# EasyEDA Pro project 栏杆机费显主板.epro, schematic Schematic1

## Sheets
1 P1: Create Date: 2023-12-23; Page Name: P1; Project Name: F407-费显; Schematic Name: Schematic1; Update Date: 2023-12-23; Company: 嘉立创EDA; Page Size: A3; Version: V1.0
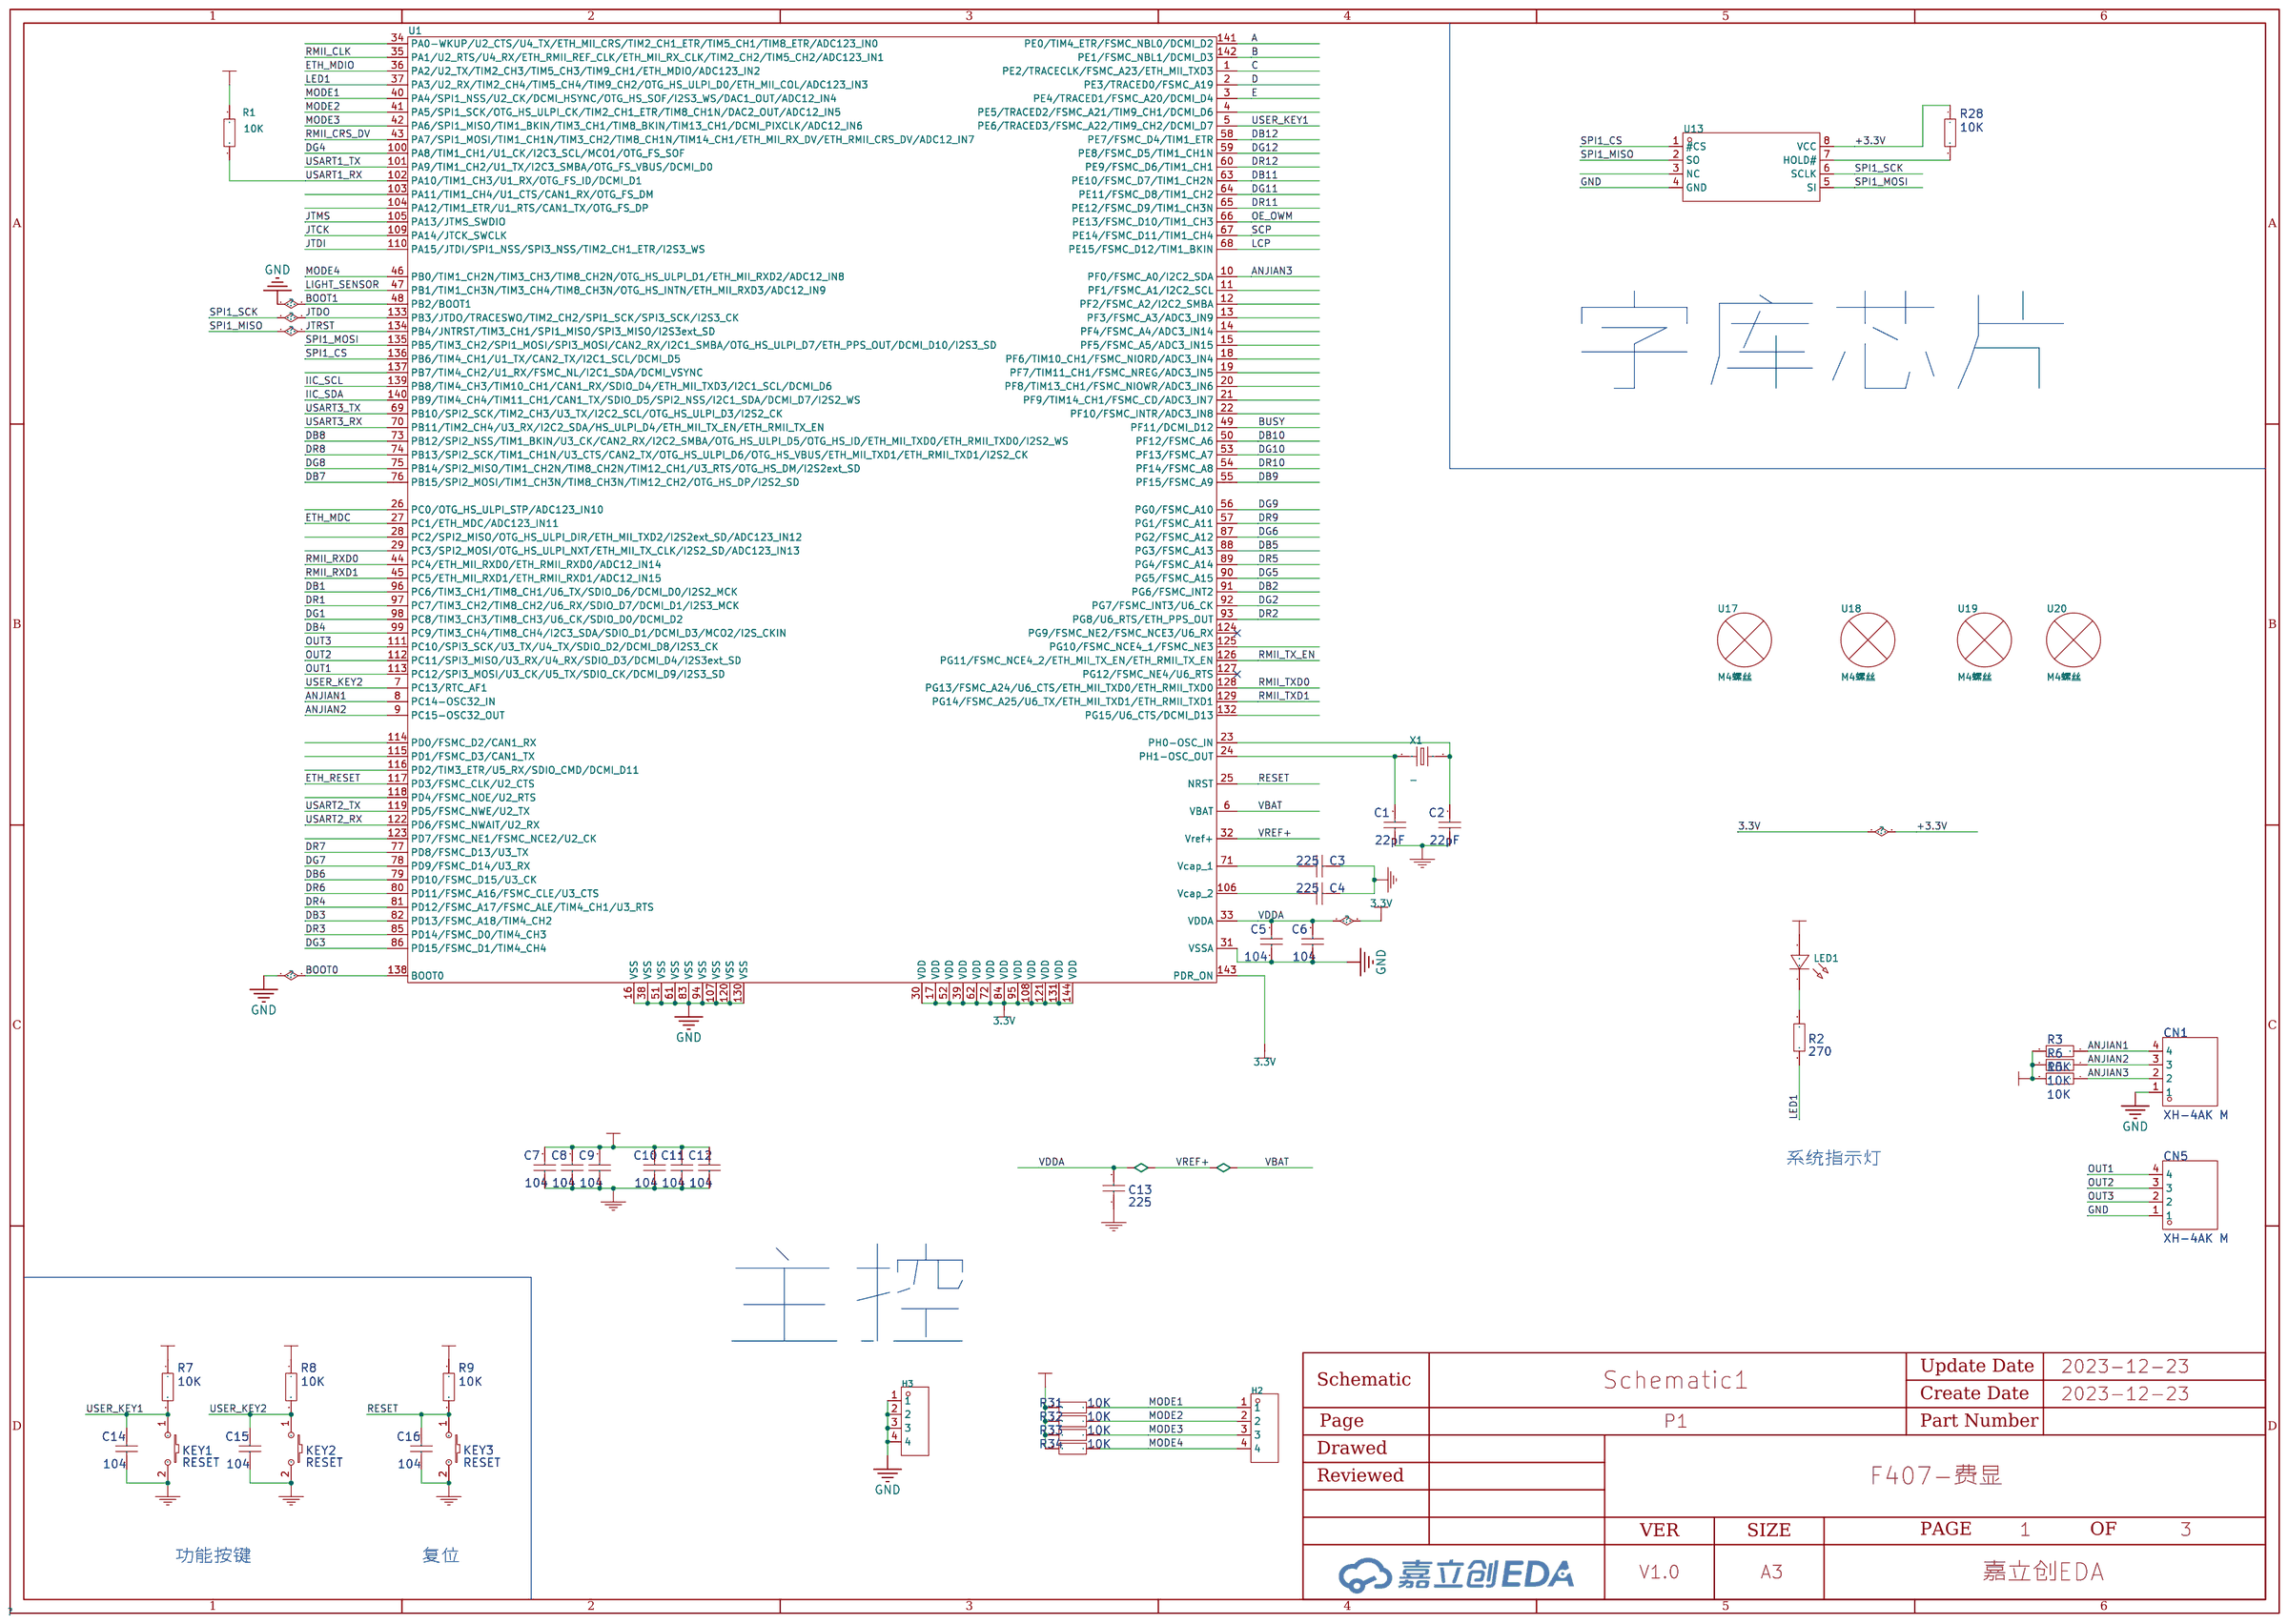
[diagram p0: P1]
2 P2: Page Name: P2
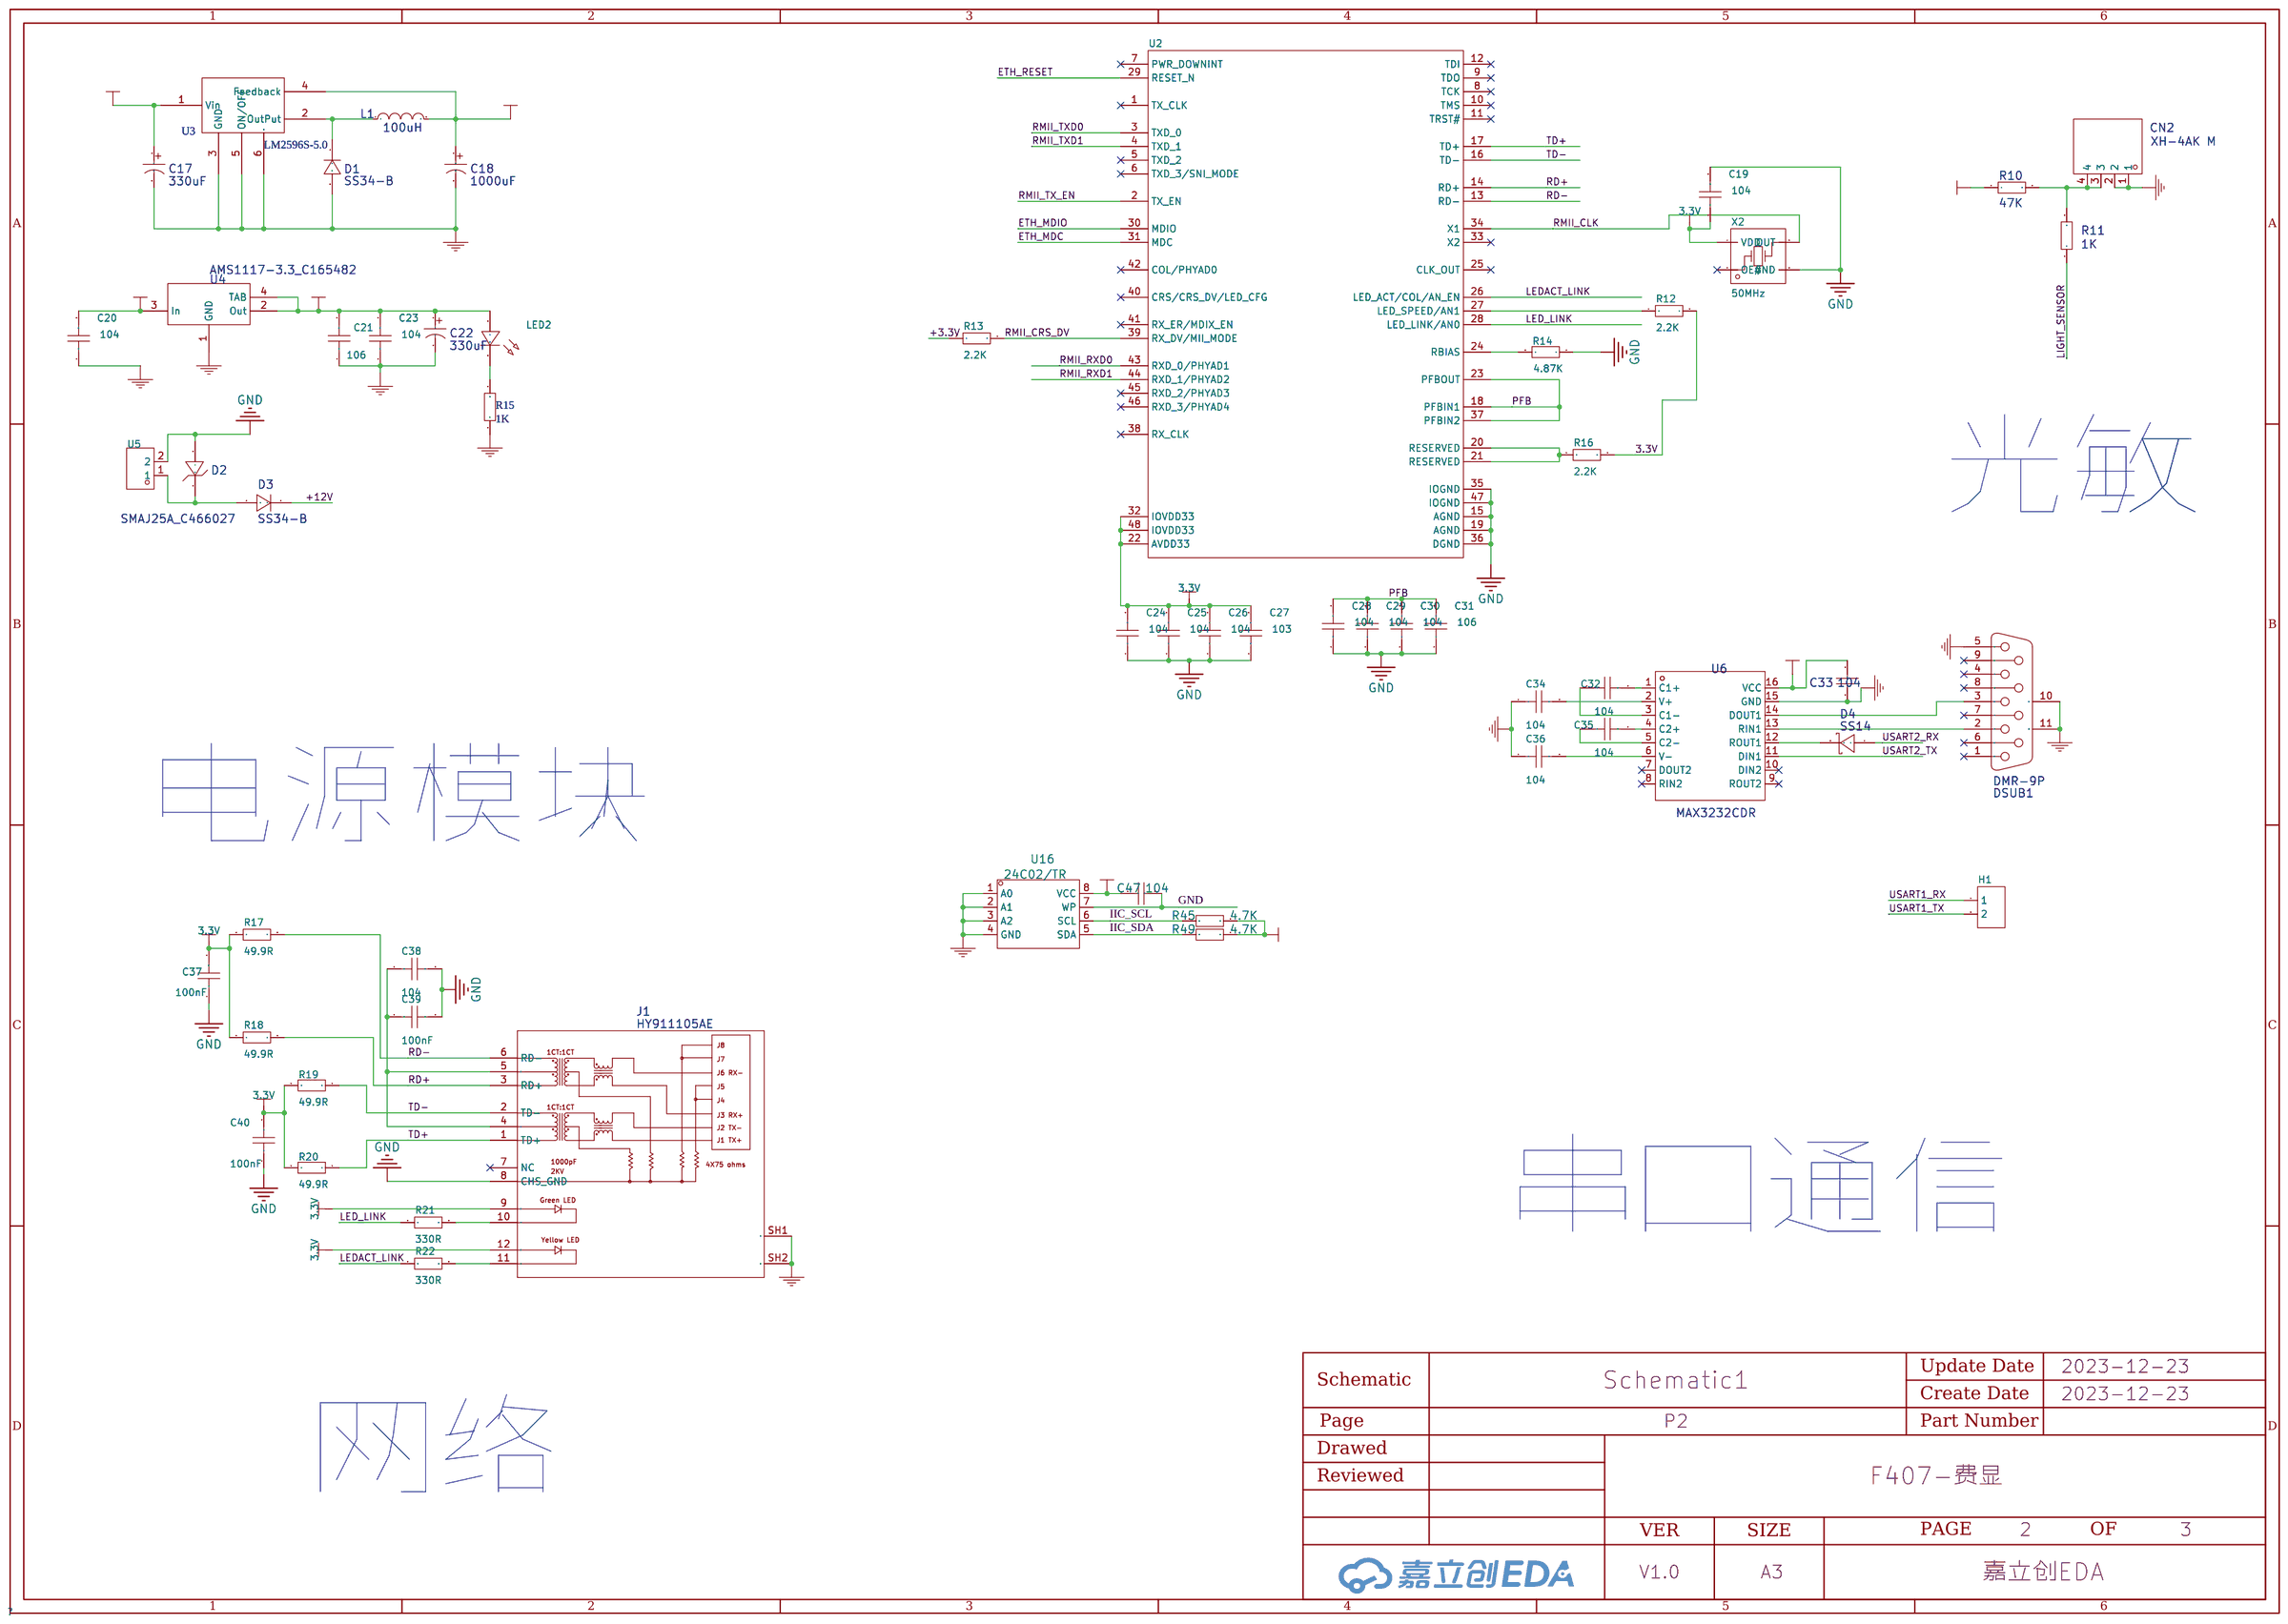
[diagram p1: P2]
3 P3: Create Date: 2023-06-13; Page Name: P3; Update Date: 2023-06-14
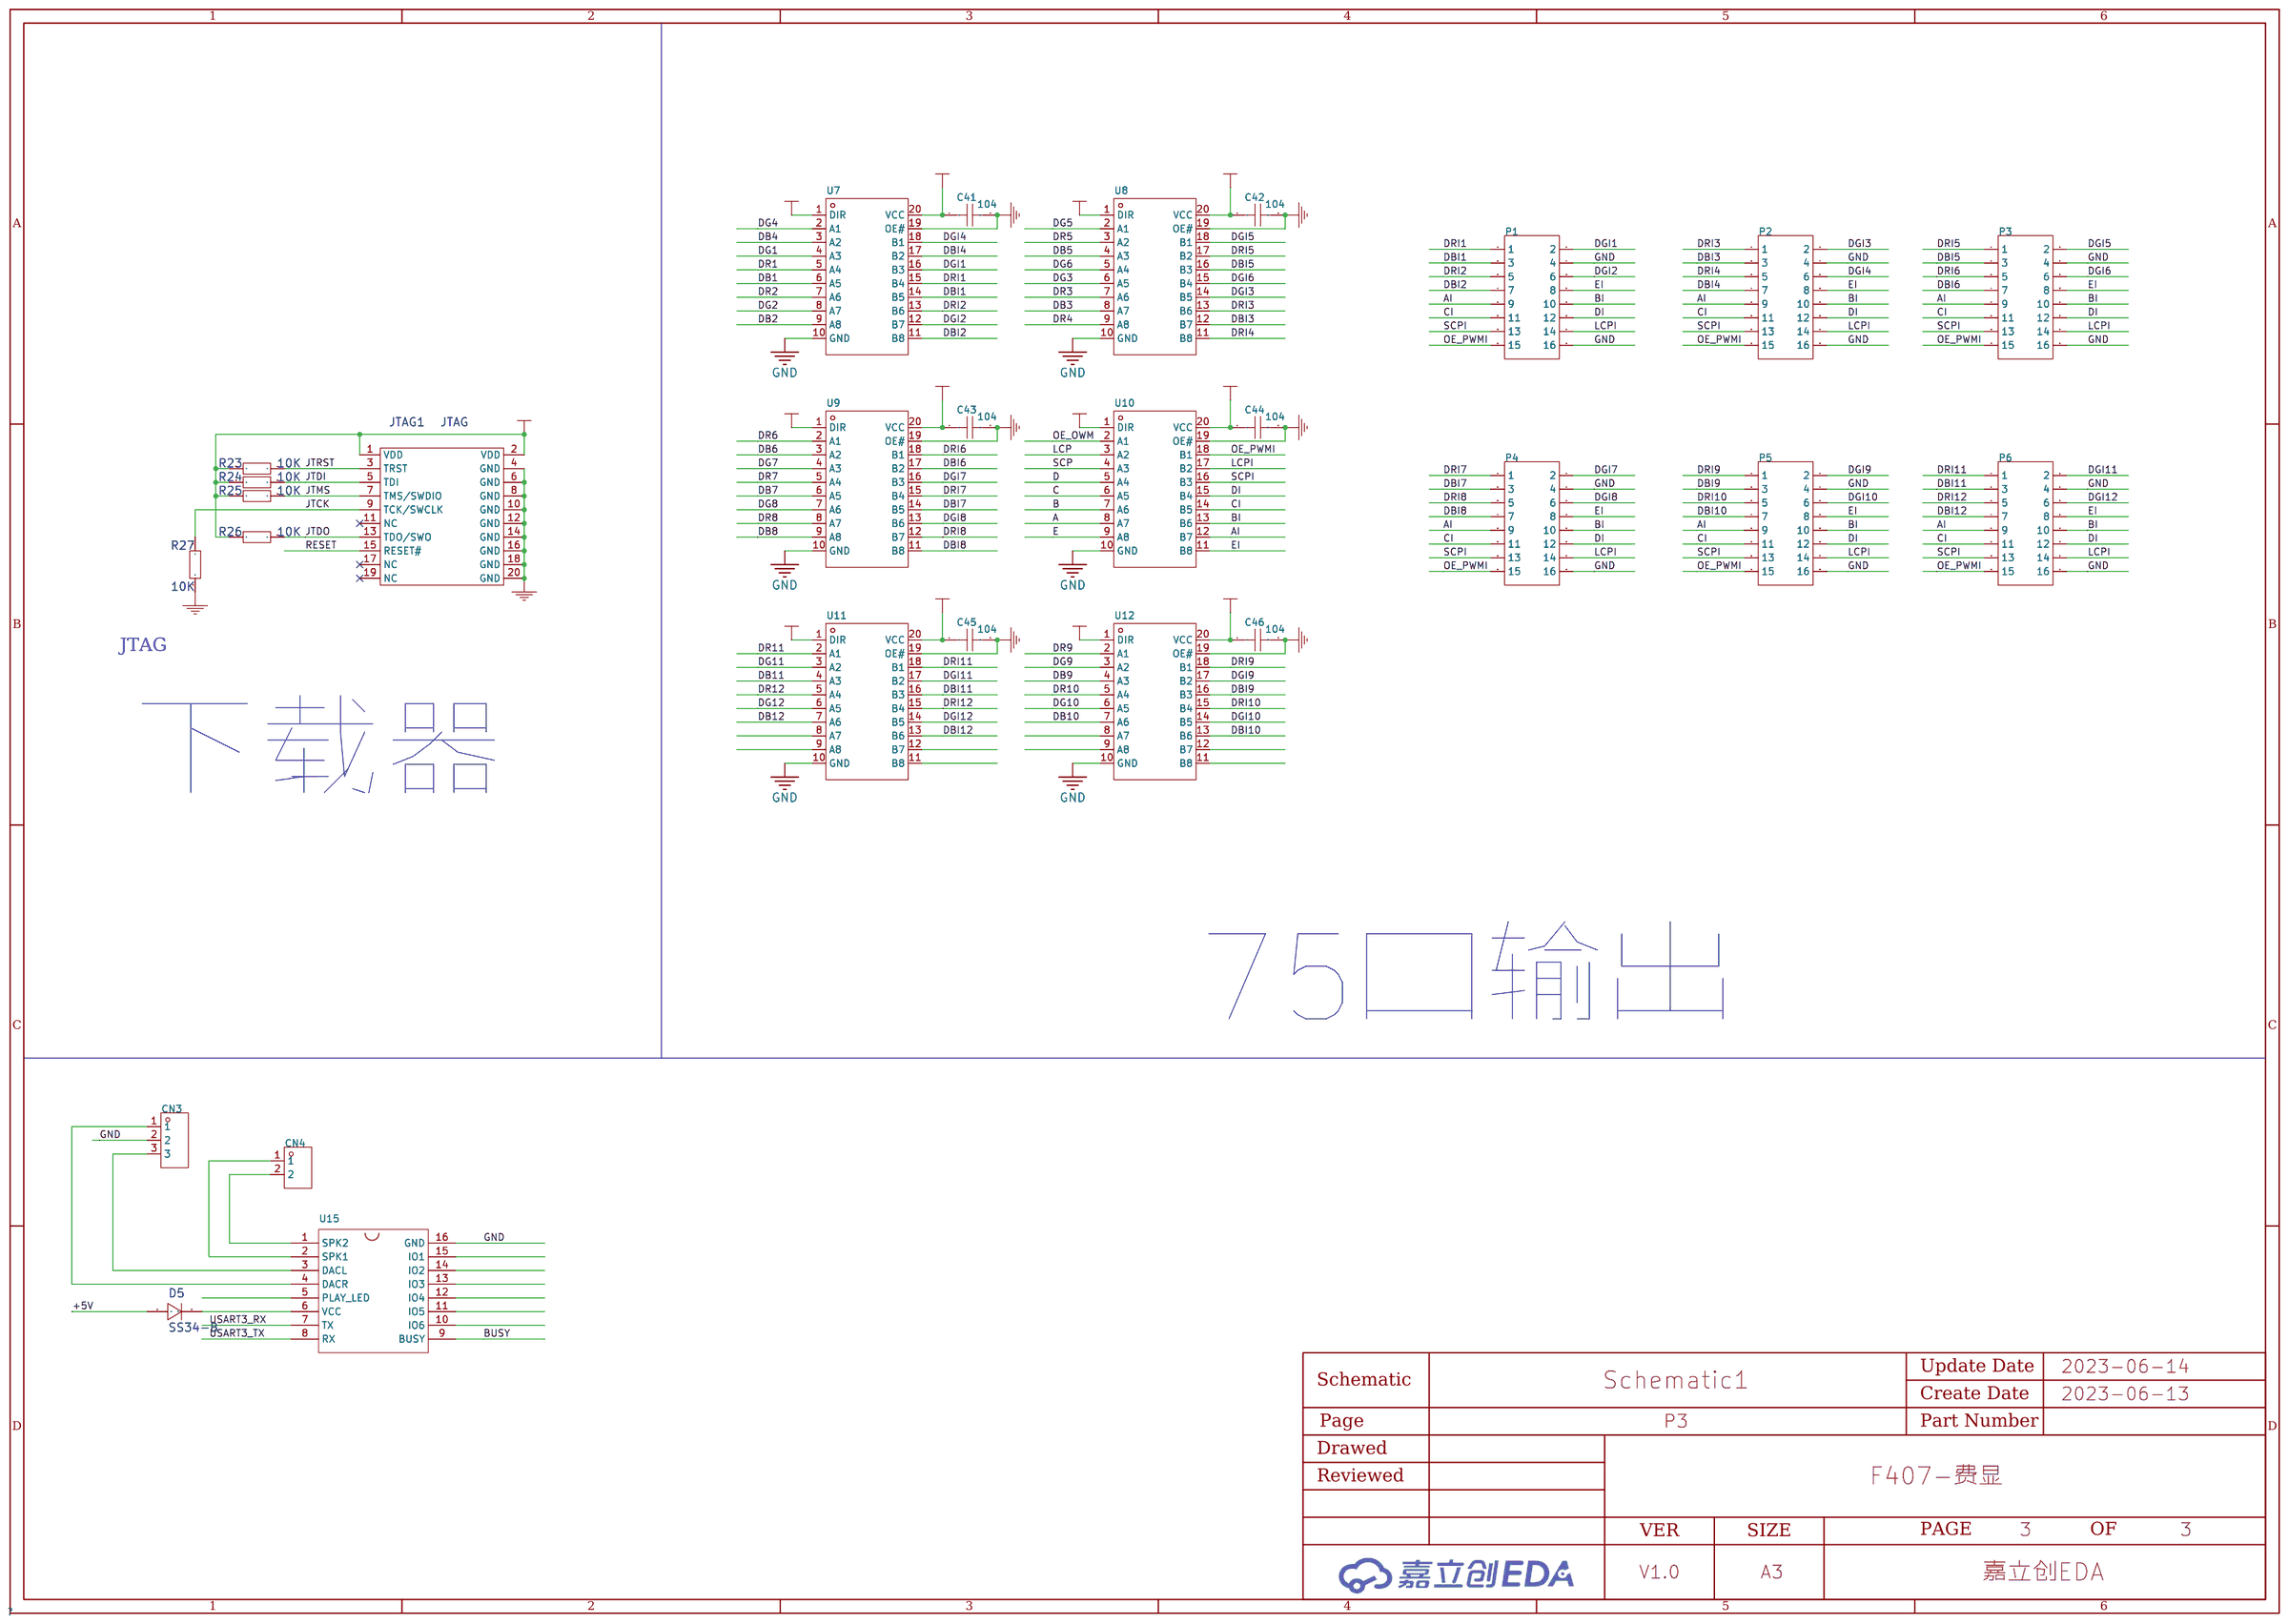
[diagram p2: P3]

## Parts
sheet P1
C1  22pF  [C0805]
C2  22pF  [C0805]
C3  225  [C0805]
C4  225  [C0805]
C5  104  [C0805]
C6  104  [C0805]
C7  104  [C0805]
C8  104  [C0805]
C9  104  [C0805]
C10  104  [C0805]
C11  104  [C0805]
C12  104  [C0805]
C13  225  [C0805]
C14  104  [C0805]
C15  104  [C0805]
C16  104  [C0805]
CN1  XH-4AK M  [CONN-TH_4P-P2.50_XH-4A]
CN5  XH-4AK M  [CONN-TH_4P-P2.50_XH-4A]
H2  -  [HDR-TH_4P-P2.54-V-M]
H3  -  [HDR-TH_4P-P2.54-V-M]
KEY1  RESET  [按键]
KEY2  RESET  [按键]
KEY3  RESET  [按键]
LED1  -  [LED0805-RD_RED]
R1  10K  [R0805]
R2  270  [R0805]
R3  10K  [R0805]
R5  10K  [R0805]
R6  10K  [R0805]
R7  10K  [R0805]
R8  10K  [R0805]
R9  10K  [R0805]
R28  10K  [R0805]
R31  10K  [R0805]
R32  10K  [R0805]
R33  10K  [R0805]
R34  10K  [R0805]
U1  -  [STM32F407ZET6]
U13  GT30L32S4W  [SOP-8_L5.3-W5.3-P1.27-LS8.0-BL]
U17  M4螺丝  [M4螺丝]
U18  M4螺丝  [M4螺丝]
U19  M4螺丝  [M4螺丝]
U20  M4螺丝  [M4螺丝]
X1  -  [HC-49US_L11.5-W4.5-P4.88]
sheet P2
C17  330uF  [直插电容C1]
C18  1000uF  [直插电容2]
C19  104  [C0805]
C20  104  [C0805]
C21  106  [C0805]
C22  330uF  [直插电容C1]
C23  104  [C0805]
C24  104  [C0805]
C25  104  [C0805]
C26  104  [C0805]
C27  103  [C0805]
C28  104  [C0805]
C29  104  [C0805]
C30  104  [C0805]
C31  106  [C0805]
C32  104  [C0805]
C33  104  [C0805]
C34  104  [C0805]
C35  104  [C0805]
C36  104  [C0805]
C37  100nF  [C0805]
C38  104  [C0805]
C39  100nF  [C0805]
C40  100nF  [C0805]
C47  104  [C0805]
CN2  XH-4AK M  [CONN-TH_4P-P2.50_XH-4A]
D1  SS34-B  [SMB_L4.6-W3.6-LS5.3-RD]
D2  SMAJ25A_C466027  [SMA_L4.4-W2.8-LS5.4-RD]
D3  SS34-B  [SMB_L4.6-W3.6-LS5.3-RD]
D4  SS14  [SMA_L4.3-W2.6-LS5.2-FD]
DSUB1  DMR-9P  [DSUB-TH_DMR-9P]
H1  -  [HDR-TH_2P-P2.54-V-F]
J1  HY911105AE  [RJ45-TH_HR911105A]
L1  100uH  [IND-SMD_L12.0-W12.0_SLH1207S]
LED2  -  [LED0805-RD_RED]
R10  47K  [R0805]
R11  1K  [R0805]
R12  2.2K  [R0805]
R13  2.2K  [R0805]
R14  4.87K  [R0805]
R15  1K  [R0805]
R16  2.2K  [R0805]
R17  49.9R  [R0805]
R18  49.9R  [R0805]
R19  49.9R  [R0805]
R20  49.9R  [R0805]
R21  330R  [R0805]
R22  330R  [R0805]
R45  4.7K  [R0805]
R49  4.7K  [R0805]
U2  DP83848IVVX/NOPB  [LQFP-48_L7.0-W7.0-P0.50-LS9.0-TL]
U3  LM2596S-5.0  [TO-263-5_L10.6-W9.6-P1.70-LS15.9-BR]
U4  AMS1117-3.3_C165482  [SOT-223_L6.5-W3.5-P2.30-LS7.0-BR]
U5  KF7.62-2P  [CONN-TH_2P-P7.62_KEFA_KF7.62-2P]
U6  MAX3232CDR  [NSOP-16_L9.9-W3.9-P1.27-LS6.0-BL]
U16  24C02/TR  [SOIC-8_L5.0-W4.0-P1.27-LS6.0-BL]
X2  50MHz  [OSC-SMD_4P-L3.2-W2.5-BL]
sheet P3
C41  104  [C0805]
C42  104  [C0805]
C43  104  [C0805]
C44  104  [C0805]
C45  104  [C0805]
C46  104  [C0805]
CN3  HX25003-3A  [CONN-TH_3P-P2.50_HX25003-3A]
CN4  HX25003-2A  [CONN-TH_2P-P2.50_HX25003-2A]
D5  SS34-B  [SMB_L4.6-W3.6-LS5.3-RD]
JTAG1  JTAG  [JTAG_20]
P1  2.54-2*8P简牛  [IDC-TH_16P-P2.54_C3406]
P2  2.54-2*8P简牛  [IDC-TH_16P-P2.54_C3406]
P3  2.54-2*8P简牛  [IDC-TH_16P-P2.54_C3406]
P4  2.54-2*8P简牛  [IDC-TH_16P-P2.54_C3406]
P5  2.54-2*8P简牛  [IDC-TH_16P-P2.54_C3406]
P6  2.54-2*8P简牛  [IDC-TH_16P-P2.54_C3406]
R23  10K  [R0805]
R24  10K  [R0805]
R25  10K  [R0805]
R26  10K  [R0805]
R27  10K  [R0805]
U7  SN74HC245PWR  [TSSOP-20_L6.5-W4.4-P0.65-LS6.4-BL]
U8  SN74HC245PWR  [TSSOP-20_L6.5-W4.4-P0.65-LS6.4-BL]
U9  SN74HC245PWR  [TSSOP-20_L6.5-W4.4-P0.65-LS6.4-BL]
U10  SN74HC245PWR  [TSSOP-20_L6.5-W4.4-P0.65-LS6.4-BL]
U11  SN74HC245PWR  [TSSOP-20_L6.5-W4.4-P0.65-LS6.4-BL]
U12  SN74HC245PWR  [TSSOP-20_L6.5-W4.4-P0.65-LS6.4-BL]
U15  b2b2b2a82eb44742a801b562c82f46ac  [BY8301]

## Library data of the parts
C1 C2 = 22
C3 C4 C13 = 225
C5 = 10uF
C6 C10-C12 C14-C16 C47 = 104
C7-C9 = CC0805KRX7R9BB104: Supplier: LCSC; Manufacturer: YAGEO; Supplier Part: C49678; JLCPCB Part Class: Basic
CN1 CN2 CN5 = XH-4AK M
H2 H3 = HDR-M_2.54_1x4P: Supplier Part: C492403; Supplier Footprint: 插件
KEY1-KEY3 = RESET: 制造商: 韩国韩荣
LED1 LED2 = LED_0805-G: Supplier Footprint: 0805
R1 R12-R14 R16-R22 = Res_0805: Supplier Part: C319941; Supplier Footprint: 0805
R2 = 270
R3 R5-R9 R23-R28 R31-R34 = 10K
U1 = STM32F407ZET6
U13 = GT30L32S4W: 字符集:-;点阵大小:-;时钟频率:-;工作温度:-;; Supplier Part: C97325; Manufacturer: GENITOP(高通); Supplier Footprint: SOP-8-208mil; JLCPCB Part Class: Extended Part; Datasheet: https://atta.szlcsc.com/upload/public/pdf/source/20220321/FF487C540DB634E6E3B2751B1DD3D486.pdf; Supplier: LCSC
U17-U20 = M4螺丝
X1 = XIHCELNANF-25MHZ: 晶振类型:-;频率:-;频率公差:-;负载电容:-;工作温度:-;; LCSC Part Name: 25MHZ 20PF30PPM -40~+85DIP; Supplier Part: C295079; Manufacturer: TAITIEN(泰艺电子); Supplier Footprint: HC-49S-2P; JLCPCB Part Class: Extended Part; Datasheet: https://atta.szlcsc.com/upload/public/pdf/source/20180928/C295079_2C551BCED97315E6FEC0145316AF7D5F.pdf; Supplier: LCSC
C17 C22 = 330uF
C18 = 1000uF
C19-C21 C23-C32 C34-C46 = CAP_0805: 容值:100nF;精度:±10%;额定电压:50V;温度系数:X7R;; Supplier Footprint: 0805
C33 = 0.1uF
D1 D3 D5 = SS34-B
D2 = SMAJ36A_C466027
D4 = SS14: image: //image.lceda.cn/szlcsc/C2480.jpg
DSUB1 = DMR-9P
H1 = HDR-F_2.54_1x2P: Supplier Part: C49661; Supplier Footprint: 插件
J1 = HY911105AE
L1 = 100uH
R10 = 47K
R11 = 1K
R15 = 1K: Published: 8-Jun-2000; LatestRevisionDate: 17-Jul-2002; LatestRevisionNote: Re-released for DXP Platform.; PackageReference: AXIAL-0.4; Publisher: Altium Limited
R45 R49 = 4.7K
U2 = DP83848IVVX/NOPB: 类型:Ethernet Transceivers;标准:10BASE-T, 100BASE-T;接口类型:MII, RMII, SNI;电源电压:3V ~ 3.6V;; Supplier Part: C12082; Manufacturer: TI(德州仪器); Supplier Footprint: LQFP-48_7x7x05P; JLCPCB Part Class: Extended Part; Datasheet: https://atta.szlcsc.com/upload/public/pdf/source/20160830/1472551521415.pdf; Supplier: LCSC; Type: Ethernet Transceivers; Number of Channels: 1; Standards: 10BASE-T, 100BASE-T; Interface: MII, RMII, SNI; Supply Voltage: 3V ~ 3.6V
U3 = LM2596S-5.0
U4 = AMS1117-3.3_C165482
U5 = KF7.62-2P_C5173665: LCSC Part Name: 绿色尼龙环保; Supplier Part: C5173665; Manufacturer: KEFA(科发); Supplier Footprint: 插件,P=7.62mm; JLCPCB Part Class: Extended Part; Datasheet: https://atta.szlcsc.com/upload/public/pdf/source/20220915/0842C98F0805CE3BBD42ED115252704B.pdf; Supplier: LCSC
U6 = MAX3232CDR: image: //image.lceda.cn/szlcsc/C45843.jpg
U16 = 24C02/TR
X2 = HSO321S 50MHZ 3.3V 50PPM -40~+85℃: 频率:50MHz;频率稳定度:±50ppm;工作电压:3.3V;工作温度:-40~+85;; LCSC Part Name: 50MHz 3.3V ±50ppm; Supplier Part: C160451; Manufacturer: HELE(台湾加高); Manufacturer Part: HSO321S 50MHZ 3.3V 50PPM -40~+85; Supplier Footprint: SMD3225-4P; JLCPCB Part Class: Extended Part; Datasheet: https://atta.szlcsc.com/upload/public/pdf/source/20180509/C160451_4CE45910C7350DD7C1B2A5D42AF0B2C2.pdf; Supplier: LCSC; Frequency Stability: ±50ppm; Supply Voltage: 3.3V; Operating Temperature: -40~+85
CN3 = HX25003-3A: 参考系列:XH;间距:2.5mm;插针结构:1x3P;排数:1;每排PIN数:3;行距:-;公母:公型插针;安装方式:直插;额定电流:-;工作温度范围:-;; LCSC Part Name: XH 2.5mm 1x3P 直插; Supplier Part: C442300; Manufacturer: HX(红星); Supplier Footprint: 插件,P=2.5mm; JLCPCB Part Class: Extended Part; Datasheet: https://atta.szlcsc.com/upload/public/pdf/source/20191028/C442300_3475A81FD16A5F63BAE06F455B8D4D60.pdf; Supplier: LCSC; Reference Series: XH; Pitch: 2.5mm; Pins Structure: 1x3P; Number of Rows: 1; Number of PINs Per Row: 3; Gender: 公型插针; Mounting Style: 直插
CN4 = HX25003-2A: 参考系列:XH;间距:2.5mm;插针结构:1x2P;排数:1;每排PIN数:2;行距:-;公母:公型插针;安装方式:直插;额定电流:-;工作温度范围:-;; LCSC Part Name: XH 2.5mm 1x2P 直插 母座; Supplier Part: C442299; Manufacturer: HX(红星); Supplier Footprint: 插件,P=2.5mm; JLCPCB Part Class: Extended Part; Datasheet: https://atta.szlcsc.com/upload/public/pdf/source/20191028/C442299_791AF061D32404B3CF2743C2F942DF66.pdf; Supplier: LCSC; Reference Series: XH; Pitch: 2.5mm; Pins Structure: 1x2P; Number of Rows: 1; Number of PINs Per Row: 2; Gender: 公型插针; Mounting Style: 直插
JTAG1 = JTAG
P1-P6 = 2.54-2*8P简牛: 连接器类型:简牛座;每排PIN数:8;排数:2;间距:2.54mm;行距:2.54mm;封装形式:直插;触头材质:-;触头镀层:-;; LCSC Part Name: 每排P数:8 排数:2 2.54mm; Supplier Part: C3406; Manufacturer: BOOMELE(博穆精密); Supplier Footprint: 插件,P=2.54mm; JLCPCB Part Class: Extended Part; Datasheet: https://atta.szlcsc.com/upload/public/pdf/source/20131122/1457706661430.pdf; Supplier: LCSC; Connector Type: 简牛座; Pin Number in each Row: 8; Number of Rows: 2; Pitch: 2.54mm; Row Spacing: 2.54mm; Holder Type: 直插
U7-U12 = SN74HC245PWR: SN74HC245 具有三态输出的八路总线收发器; Supplier Part: C37101; Manufacturer: TI(德州仪器); Supplier Footprint: TSSOP-20; JLCPCB Part Class: Extended Part; Datasheet: https://atta.szlcsc.com/upload/public/pdf/source/20140924/1457707242165.pdf; Supplier: LCSC
U15 = BY8301-16P 串口语音模块: 串口语音模块MP3芯片播放板 游乐音频声音播报USB下载 BY8301-16P; _: 3

## Nets
+3.3V: C5.2 C6.2 C7.2 C8.2 C9.2 C10.2 C11.2 C12.2 C13.1 C19.1 C21.2 C22.1 C23.2 C24.2 C25.2 C26.2 C27.2 C33.2 C37.2 C40.2 C47.2 J1.9 J1.12 JTAG1.1(VDD) JTAG1.2(VDD) LED1.2(A) LED2.2(A) R1.2 R3.2 R5.2 R6.2 R7.1 R8.1 R9.1 R10.1 R12.2 R13.1 R16.2 R17.1 R18.1 R19.2 R20.2 R23.2 R24.2 R25.2 R26.2 R28.1 R31.2 R32.2 R33.2 R34.2 R45.1 R49.1 U1.6(VBAT) U1.17(VDD) U1.30(VDD) U1.32(Vref+) U1.33(VDDA) U1.39(VDD) U1.52(VDD) U1.62(VDD) U1.72(VDD) U1.84(VDD) U1.95(VDD) U1.108(VDD) U1.121(VDD) U1.131(VDD) U1.143(PDR_ON) U1.144(VDD) U2.22(AVDD33) U2.32(IOVDD33) U2.48(IOVDD33) U4.2(Out) U4.4(TAB) U6.16(VCC) U13.8(VCC) U16.8(VCC) X2.4(VDD)
+5V: C18.1 C20.2 C41.1 C42.1 C43.1 C44.1 C45.1 C46.1 D5.2 L1.2 U3.4(Feedback) U4.3(In) U7.1(DIR) U7.20(VCC) U8.1(DIR) U8.20(VCC) U9.1(DIR) U9.20(VCC) U10.1(DIR) U10.20(VCC) U11.1(DIR) U11.20(VCC) U12.1(DIR) U12.20(VCC)
+12V: C17.1 D3.1 U3.1(Vin)
GND: C1.1 C2.1 C3.1 C4.1 C5.1 C6.1 C7.1 C8.1 C9.1 C10.1 C11.1 C12.1 C13.2 C14.2 C15.2 C16.2 C17.2 C18.2 C19.2 C20.1 C21.1 C22.2 C23.1 C24.1 C25.1 C26.1 C27.1 C28.1 C29.1 C30.1 C31.1 C33.1 C34.1 C36.1 C37.1 C38.2 C39.2 C40.1 C41.2 C42.2 C43.2 C44.2 C45.2 C46.2 C47.1 CN1.1 CN2.1 CN2.2 CN3.2 CN5.1 D1.2 D2.2(A) DSUB1.5 DSUB1.10(MH1) DSUB1.11(MH2) H3.1 H3.2 H3.3 H3.4 J1.8(CHS GND) J1.SH1 J1.SH2 JTAG1.4(GND) JTAG1.6(GND) JTAG1.8(GND) JTAG1.10(GND) JTAG1.12(GND) JTAG1.14(GND) JTAG1.16(GND) JTAG1.18(GND) JTAG1.20(GND) KEY1.2 KEY2.2 KEY3.2 P1.4 P1.16 P2.4 P2.16 P3.4 P3.16 P4.4 P4.16 P5.4 P5.16 P6.4 P6.16 R14.1 R15.2 R27.2 U1.16(VSS) U1.31(VSSA) U1.38(VSS) U1.48(PB2/BOOT1) U1.51(VSS) U1.61(VSS) U1.83(VSS) U1.94(VSS) U1.107(VSS) U1.120(VSS) U1.130(VSS) U1.138(BOOT0) U2.15(AGND) U2.19(AGND) U2.35(IOGND) U2.36(DGND) U2.47(IOGND) U3.3(GND) U3.5(ON/OFF) U3.6 U4.1(GND) U5.2 U6.15(GND) U7.10(GND) U7.19(OE#) U8.10(GND) U8.19(OE#) U9.10(GND) U9.19(OE#) U10.10(GND) U10.19(OE#) U11.10(GND) U11.19(OE#) U12.10(GND) U12.19(OE#) U13.4(GND) U15.16(GND) U16.1(A0) U16.2(A1) U16.3(A2) U16.4(GND) U16.7(WP) X2.2(GND)
A: U1.141(PE0/TIM4_ETR/FSMC_NBL0/DCMI_D2) U10.8(A7)
AI: P1.9 P2.9 P3.9 P4.9 P5.9 P6.9 U10.12(B7)
ANJIAN1: CN1.4 R3.1 U1.8(PC14-OSC32_IN)
ANJIAN2: CN1.3 R6.1 U1.9(PC15-OSC32_OUT)
ANJIAN3: CN1.2 R5.1 U1.10(PF0/FSMC_A0/I2C2_SDA)
B: U1.142(PE1/FSMC_NBL1/DCMI_D3) U10.7(A6)
BI: P1.10 P2.10 P3.10 P4.10 P5.10 P6.10 U10.13(B6)
BUSY: U1.49(PF11/DCMI_D12) U15.9(BUSY)
C: U1.1(PE2/TRACECLK/FSMC_A23/ETH_MII_TXD3) U10.6(A5)
CI: P1.11 P2.11 P3.11 P4.11 P5.11 P6.11 U10.14(B5)
D: U1.2(PE3/TRACED0/FSMC_A19) U10.5(A4)
DB1: U1.96(PC6/TIM3_CH1/TIM8_CH1/U6_TX/SDIO_D6/DCMI_D0/I2S2_MCK) U7.6(A5)
DB2: U1.91(PG6/FSMC_INT2) U7.9(A8)
DB3: U1.82(PD13/FSMC_A18/TIM4_CH2) U8.8(A7)
DB4: U1.99(PC9/TIM3_CH4/TIM8_CH4/I2C3_SDA/SDIO_D1/DCMI_D3/MCO2/I2S_CKIN) U7.3(A2)
DB5: U1.88(PG3/FSMC_A13) U8.4(A3)
DB6: U1.79(PD10/FSMC_D15/U3_CK) U9.3(A2)
DB7: U1.76(PB15/SPI2_MOSI/TIM1_CH3N/TIM8_CH3N/TIM12_CH2/OTG_HS_DP/I2S2_SD) U9.6(A5)
DB8: U1.73(PB12/SPI2_NSS/TIM1_BKIN/U3_CK/CAN2_RX/I2C2_SMBA/OTG_HS_ULPI_D5/OTG_HS_ID/ETH_MII_TXD0/ETH_RMII_TXD0/I2S2_WS) U9.9(A8)
DB9: U1.55(PF15/FSMC_A9) U12.4(A3)
DB10: U1.50(PF12/FSMC_A6) U12.7(A6)
DB11: U1.63(PE10/FSMC_D7/TIM1_CH2N) U11.4(A3)
DB12: U1.58(PE7/FSMC_D4/TIM1_ETR) U11.7(A6)
DBI1: P1.3 U7.14(B5)
DBI2: P1.7 U7.11(B8)
DBI3: P2.3 U8.12(B7)
DBI4: P2.7 U7.17(B2)
DBI5: P3.3 U8.16(B3)
DBI6: P3.7 U9.17(B2)
DBI7: P4.3 U9.14(B5)
DBI8: P4.7 U9.11(B8)
DBI9: P5.3 U12.16(B3)
DBI10: P5.7 U12.13(B6)
DBI11: P6.3 U11.16(B3)
DBI12: P6.7 U11.13(B6)
DG1: U1.98(PC8/TIM3_CH3/TIM8_CH3/U6_CK/SDIO_D0/DCMI_D2) U7.4(A3)
DG2: U1.92(PG7/FSMC_INT3/U6_CK) U7.8(A7)
DG3: U1.86(PD15/FSMC_D1/TIM4_CH4) U8.6(A5)
DG4: U1.100(PA8/TIM1_CH1/U1_CK/I2C3_SCL/MCO1/OTG_FS_SOF) U7.2(A1)
DG5: U1.90(PG5/FSMC_A15) U8.2(A1)
DG6: U1.87(PG2/FSMC_A12) U8.5(A4)
DG7: U1.78(PD9/FSMC_D14/U3_RX) U9.4(A3)
DG8: U1.75(PB14/SPI2_MISO/TIM1_CH2N/TIM8_CH2N/TIM12_CH1/U3_RTS/OTG_HS_DM/I2S2ext_SD) U9.7(A6)
DG9: U1.56(PG0/FSMC_A10) U12.3(A2)
DG10: U1.53(PF13/FSMC_A7) U12.6(A5)
DG11: U1.64(PE11/FSMC_D8/TIM1_CH2) U11.3(A2)
DG12: U1.59(PE8/FSMC_D5/TIM1_CH1N) U11.6(A5)
DGI1: P1.2 U7.16(B3)
DGI2: P1.6 U7.12(B7)
DGI3: P2.2 U8.14(B5)
DGI4: P2.6 U7.18(B1)
DGI5: P3.2 U8.18(B1)
DGI6: P3.6 U8.15(B4)
DGI7: P4.2 U9.16(B3)
DGI8: P4.6 U9.13(B6)
DGI9: P5.2 U12.17(B2)
DGI10: P5.6 U12.14(B5)
DGI11: P6.2 U11.17(B2)
DGI12: P6.6 U11.14(B5)
DI: P1.12 P2.12 P3.12 P4.12 P5.12 P6.12 U10.15(B4)
DR1: U1.97(PC7/TIM3_CH2/TIM8_CH2/U6_RX/SDIO_D7/DCMI_D1/I2S3_MCK) U7.5(A4)
DR2: U1.93(PG8/U6_RTS/ETH_PPS_OUT) U7.7(A6)
DR3: U1.85(PD14/FSMC_D0/TIM4_CH3) U8.7(A6)
DR4: U1.81(PD12/FSMC_A17/FSMC_ALE/TIM4_CH1/U3_RTS) U8.9(A8)
DR5: U1.89(PG4/FSMC_A14) U8.3(A2)
DR6: U1.80(PD11/FSMC_A16/FSMC_CLE/U3_CTS) U9.2(A1)
DR7: U1.77(PD8/FSMC_D13/U3_TX) U9.5(A4)
DR8: U1.74(PB13/SPI2_SCK/TIM1_CH1N/U3_CTS/CAN2_TX/OTG_HS_ULPI_D6/OTG_HS_VBUS/ETH_MII_TXD1/ETH_RMII_TXD1/I2S2_CK) U9.8(A7)
DR9: U1.57(PG1/FSMC_A11) U12.2(A1)
DR10: U1.54(PF14/FSMC_A8) U12.5(A4)
DR11: U1.65(PE12/FSMC_D9/TIM1_CH3N) U11.2(A1)
DR12: U1.60(PE9/FSMC_D6/TIM1_CH1) U11.5(A4)
DRI1: P1.1 U7.15(B4)
DRI2: P1.5 U7.13(B6)
DRI3: P2.1 U8.13(B6)
DRI4: P2.5 U8.11(B8)
DRI5: P3.1 U8.17(B2)
DRI6: P3.5 U9.18(B1)
DRI7: P4.1 U9.15(B4)
DRI8: P4.5 U9.12(B7)
DRI9: P5.1 U12.18(B1)
DRI10: P5.5 U12.15(B4)
DRI11: P6.1 U11.18(B1)
DRI12: P6.5 U11.15(B4)
E: U1.3(PE4/TRACED1/FSMC_A20/DCMI_D4) U10.9(A8)
EI: P1.8 P2.8 P3.8 P4.8 P5.8 P6.8 U10.11(B8)
ETH_MDC: U1.27(PC1/ETH_MDC/ADC123_IN11) U2.31(MDC)
ETH_MDIO: U1.36(PA2/U2_TX/TIM2_CH3/TIM5_CH3/TIM9_CH1/ETH_MDIO/ADC123_IN2) U2.30(MDIO)
ETH_RESET: U1.117(PD3/FSMC_CLK/U2_CTS) U2.29(RESET_N)
IIC_SCL: R45.2 U1.139(PB8/TIM4_CH3/TIM10_CH1/CAN1_RX/SDIO_D4/ETH_MII_TXD3/I2C1_SCL/DCMI_D6) U16.6(SCL)
IIC_SDA: R49.2 U1.140(PB9/TIM4_CH4/TIM11_CH1/CAN1_TX/SDIO_D5/SPI2_NSS/I2C1_SDA/DCMI_D7/I2S2_WS) U16.5(SDA)
JTCK: JTAG1.9(TCK/SWCLK) R27.1 U1.109(PA14/JTCK_SWCLK)
JTDI: JTAG1.5(TDI) R24.1 U1.110(PA15/JTDI/SPI1_NSS/SPI3_NSS/TIM2_CH1_ETR/I2S3_WS)
JTDO: JTAG1.13(TDO/SWO) R26.1 U1.133(PB3/JTDO/TRACESWO/TIM2_CH2/SPI1_SCK/SPI3_SCK/I2S3_CK) U13.6(SCLK)
JTMS: JTAG1.7(TMS/SWDIO) R25.1 U1.105(PA13/JTMS_SWDIO)
JTRST: JTAG1.3(TRST) R23.1 U1.134(PB4/JNTRST/TIM3_CH1/SPI1_MISO/SPI3_MISO/I2S3ext_SD) U13.2(SO)
LCP: U1.68(PE15/FSMC_D12/TIM1_BKIN) U10.3(A2)
LCPI: P1.14 P2.14 P3.14 P4.14 P5.14 P6.14 U10.17(B2)
LED1: R2.2 U1.37(PA3/U2_RX/TIM2_CH4/TIM5_CH4/TIM9_CH2/OTG_HS_ULPI_D0/ETH_MII_COL/ADC123_IN3)
LED_LINK: R21.1 U2.28(LED_LINK/AN0)
LEDACT_LINK: R22.1 U2.26(LED_ACT/COL/AN_EN)
LIGHT_SENSOR: R11.1 U1.47(PB1/TIM1_CH3N/TIM3_CH4/TIM8_CH3N/OTG_HS_INTN/ETH_MII_RXD3/ADC12_IN9)
MODE1: H2.1 R31.1 U1.40(PA4/SPI1_NSS/U2_CK/DCMI_HSYNC/OTG_HS_SOF/I2S3_WS/DAC1_OUT/ADC12_IN4)
MODE2: H2.2 R32.1 U1.41(PA5/SPI1_SCK/OTG_HS_ULPI_CK/TIM2_CH1_ETR/TIM8_CH1N/DAC2_OUT/ADC12_IN5)
MODE3: H2.3 R33.1 U1.42(PA6/SPI1_MISO/TIM1_BKIN/TIM3_CH1/TIM8_BKIN/TIM13_CH1/DCMI_PIXCLK/ADC12_IN6)
MODE4: H2.4 R34.1 U1.46(PB0/TIM1_CH2N/TIM3_CH3/TIM8_CH2N/OTG_HS_ULPI_D1/ETH_MII_RXD2/ADC12_IN8)
OE_OWM: U1.66(PE13/FSMC_D10/TIM1_CH3) U10.2(A1)
OE_PWMI: P1.15 P2.15 P3.15 P4.15 P5.15 P6.15 U10.18(B1)
OUT1: CN5.4 U1.113(PC12/SPI3_MOSI/U3_CK/U5_TX/SDIO_CK/DCMI_D9/I2S3_SD)
OUT2: CN5.3 U1.112(PC11/SPI3_MISO/U3_RX/U4_RX/SDIO_D3/DCMI_D4/I2S3ext_SD)
OUT3: CN5.2 U1.111(PC10/SPI3_SCK/U3_TX/U4_TX/SDIO_D2/DCMI_D8/I2S3_CK)
PFB: C28.2 C29.2 C30.2 C31.2 U2.18(PFBIN1) U2.23(PFBOUT) U2.37(PFBIN2)
RD+: J1.3(RD+) R18.2 U2.14(RD+)
RD-: J1.6(RD-) R17.2 U2.13(RD-)
RESET: C16.1 JTAG1.15(RESET#) KEY3.1 R9.2 U1.25(NRST)
RMII_CLK: U1.35(PA1/U2_RTS/U4_RX/ETH_RMII_REF_CLK/ETH_MII_RX_CLK/TIM2_CH2/TIM5_CH2/ADC123_IN1) U2.34(X1) X2.3(OUT)
RMII_CRS_DV: R13.2 U1.43(PA7/SPI1_MOSI/TIM1_CH1N/TIM3_CH2/TIM8_CH1N/TIM14_CH1/ETH_MII_RX_DV/ETH_RMII_CRS_DV/ADC12_IN7) U2.39(RX_DV/MII_MODE)
RMII_RXD0: U1.44(PC4/ETH_MII_RXD0/ETH_RMII_RXD0/ADC12_IN14) U2.43(RXD_0/PHYAD1)
RMII_RXD1: U1.45(PC5/ETH_MII_RXD1/ETH_RMII_RXD1/ADC12_IN15) U2.44(RXD_1/PHYAD2)
RMII_TX_EN: U1.126(PG11/FSMC_NCE4_2/ETH_MII_TX_EN/ETH_RMII_TX_EN) U2.2(TX_EN)
RMII_TXD0: U1.128(PG13/FSMC_A24/U6_CTS/ETH_MII_TXD0/ETH_RMII_TXD0) U2.3(TXD_0)
RMII_TXD1: U1.129(PG14/FSMC_A25/U6_TX/ETH_MII_TXD1/ETH_RMII_TXD1) U2.4(TXD_1)
SCP: U1.67(PE14/FSMC_D11/TIM1_CH4) U10.4(A3)
SCPI: P1.13 P2.13 P3.13 P4.13 P5.13 P6.13 U10.16(B3)
SPI1_CS: U1.136(PB6/TIM4_CH1/U1_TX/CAN2_TX/I2C1_SCL/DCMI_D5) U13.1(#CS)
SPI1_MOSI: U1.135(PB5/TIM3_CH2/SPI1_MOSI/SPI3_MOSI/CAN2_RX/I2C1_SMBA/OTG_HS_ULPI_D7/ETH_PPS_OUT/DCMI_D10/I2S3_SD) U13.5(SI)
TD+: J1.1(TD+) R20.1 U2.17(TD+)
TD-: J1.2(TD-) R19.1 U2.16(TD-)
USART1_RX: H1.1 R1.1 U1.102(PA10/TIM1_CH3/U1_RX/OTG_FS_ID/DCMI_D1)
USART1_TX: H1.2 U1.101(PA9/TIM1_CH2/U1_TX/I2C3_SMBA/OTG_FS_VBUS/DCMI_D0)
USART2_RX: D4.1(A) U1.122(PD6/FSMC_NWAIT/U2_RX)
USART2_TX: U1.119(PD5/FSMC_NWE/U2_TX) U6.11(DIN1)
USART3_RX: U1.70(PB11/TIM2_CH4/U3_RX/I2C2_SDA/HS_ULPI_D4/ETH_MII_TX_EN/ETH_RMII_TX_EN) U15.7(TX)
USART3_TX: U1.69(PB10/SPI2_SCK/TIM2_CH3/U3_TX/I2C2_SCL/OTG_HS_ULPI_D3/I2S2_CK) U15.8(RX)
USER_KEY1: C14.1 KEY1.1 R7.2 U1.5(PE6/TRACED3/FSMC_A22/TIM9_CH2/DCMI_D7)
USER_KEY2: C15.1 KEY2.1 R8.2 U1.7(PC13/RTC_AF1)
$1N1791: LED1.1(C) R2.1
$1N1816: C2.2 U1.23(PH0-OSC_IN) X1.2
$1N1817: C1.2 U1.24(PH1-OSC_OUT) X1.1
$1N1842: C4.2 U1.106(Vcap_2)
$1N1843: C3.2 U1.71(Vcap_1)
$1N2722: R28.2 U13.7(HOLD#)
$2N1395: J1.10 R21.2
$2N1396: J1.11 R22.2
$2N1404: C38.1 C39.1 J1.4 J1.5
$2N1428: CN2.3 CN2.4 R10.2 R11.2
$2N1443: R14.2 U2.24(RBIAS)
$2N1463: R12.1 U2.27(LED_SPEED/AN1)
$2N1466: R16.1 U2.20(RESERVED) U2.21(RESERVED)
$2N1483: D1.1 L1.1 U3.2(OutPut)
$2N1487: LED2.1(C) R15.1
$2N2034: DSUB1.3 U6.14(DOUT1)
$2N2035: D4.2(K) U6.12(ROUT1)
$2N2036: DSUB1.2 U6.13(RIN1)
$2N2038: C36.2 U6.6(V-)
$2N2039: C35.1 U6.5(C2-)
$2N2040: C35.2 U6.4(C2+)
$2N2041: C32.1 U6.3(C1-)
$2N2042: C32.2 U6.1(C1+)
$2N2067: C34.2 U6.2(V+)
$2N2559: D2.1(C) D3.2 U5.1
$3N5262: D5.1 U15.6(VCC)
$3N6140: CN3.3 U15.3(DACL)
$3N6150: CN3.1 U15.4(DACR)
$3N6266: CN4.2 U15.1(SPK2)
$3N6270: CN4.1 U15.2(SPK1)

Not connected (* = marked no-connect by the designer): DSUB1 1* 4* 6* 7* 8* 9*; J1 7(NC)*; JTAG1 11(NC)* 17(NC)* 19(NC)*; U1 4(PE5/TRACED2/FSMC_A21/TIM9_CH1/DCMI_D6) 11(PF1/FSMC_A1/I2C2_SCL) 12(PF2/FSMC_A2/I2C2_SMBA) 13(PF3/FSMC_A3/ADC3_IN9) 14(PF4/FSMC_A4/ADC3_IN14) 15(PF5/FSMC_A5/ADC3_IN15) 18(PF6/TIM10_CH1/FSMC_NIORD/ADC3_IN4) 19(PF7/TIM11_CH1/FSMC_NREG/ADC3_IN5) 20(PF8/TIM13_CH1/FSMC_NIOWR/ADC3_IN6) 21(PF9/TIM14_CH1/FSMC_CD/ADC3_IN7) 22(PF10/FSMC_INTR/ADC3_IN8) 26(PC0/OTG_HS_ULPI_STP/ADC123_IN10) 28(PC2/SPI2_MISO/OTG_HS_ULPI_DIR/ETH_MII_TXD2/I2S2ext_SD/ADC123_IN12) 29(PC3/SPI2_MOSI/OTG_HS_ULPI_NXT/ETH_MII_TX_CLK/I2S2_SD/ADC123_IN13) 34(PA0-WKUP/U2_CTS/U4_TX/ETH_MII_CRS/TIM2_CH1_ETR/TIM5_CH1/TIM8_ETR/ADC123_IN0) 103(PA11/TIM1_CH4/U1_CTS/CAN1_RX/OTG_FS_DM) 104(PA12/TIM1_ETR/U1_RTS/CAN1_TX/OTG_FS_DP) 114(PD0/FSMC_D2/CAN1_RX) 115(PD1/FSMC_D3/CAN1_TX) 116(PD2/TIM3_ETR/U5_RX/SDIO_CMD/DCMI_D11) 118(PD4/FSMC_NOE/U2_RTS) 123(PD7/FSMC_NE1/FSMC_NCE2/U2_CK) 124(PG9/FSMC_NE2/FSMC_NCE3/U6_RX)* 125(PG10/FSMC_NCE4_1/FSMC_NE3) 127(PG12/FSMC_NE4/U6_RTS)* 132(PG15/U6_CTS/DCMI_D13) 137(PB7/TIM4_CH2/U1_RX/FSMC_NL/I2C1_SDA/DCMI_VSYNC); U2 1(TX_CLK)* 5(TXD_2)* 6(TXD_3/SNI_MODE)* 7(PWR_DOWNINT)* 8(TCK)* 9(TDO)* 10(TMS)* 11(TRST#)* 12(TDI)* 25(CLK_OUT)* 33(X2)* 38(RX_CLK)* 40(CRS/CRS_DV/LED_CFG)* 41(RX_ER/MDIX_EN)* 42(COL/PHYAD0)* 45(RXD_2/PHYAD3)* 46(RXD_3/PHYAD4)*; U6 7(DOUT2)* 8(RIN2)* 9(ROUT2)* 10(DIN2)*; U11 8(A7) 9(A8) 11(B8) 12(B7); U12 8(A7) 9(A8) 11(B8) 12(B7); U13 3(NC); U15 5(PLAY_LED) 10(IO6) 11(IO5) 12(IO4) 13(IO3) 14(IO2) 15(IO1); X2 1(OE#)*

## Notes on the sheets
sheet 1
- 字库芯片
- 系统指示灯
- 主控
- 功能按键
- 复位
sheet 2
- 光敏
- 电源模块
- 串口通信
- 网络
sheet 3
- JTAG
- 下载器
- 75口输出
